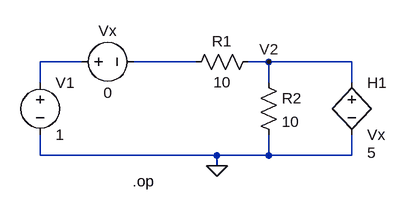
[diagram p0: schematic nodal10.asc]
nodal10.asc, the LTspice schematic file:
Version 4
SHEET 1 880 680
WIRE -112 80 -176 80
WIRE 64 80 -32 80
WIRE 176 80 144 80
WIRE 304 80 176 80
WIRE -176 112 -176 80
WIRE 176 112 176 80
WIRE 304 112 304 80
WIRE -176 224 -176 192
WIRE 96 224 -176 224
WIRE 176 224 176 192
WIRE 176 224 96 224
WIRE 304 224 304 192
WIRE 304 224 176 224
WIRE 96 240 96 224
FLAG 96 240 0
FLAG 176 80 V2
SYMBOL voltage -176 96 R0
WINDOW 123 0 0 Left 0
WINDOW 39 0 0 Left 0
SYMATTR InstName V1
SYMATTR Value 1
SYMBOL res 160 64 R90
WINDOW 0 0 56 VBottom 2
WINDOW 3 32 56 VTop 2
SYMATTR InstName R1
SYMATTR Value 10
SYMBOL res 160 96 R0
SYMATTR InstName R2
SYMATTR Value 10
SYMBOL h 304 96 R0
WINDOW 123 24 124 Left 2
SYMATTR InstName H1
SYMATTR Value Vx
SYMATTR Value2 5
SYMBOL voltage -128 80 R270
WINDOW 0 32 56 VTop 2
WINDOW 3 -32 56 VBottom 2
WINDOW 123 0 0 Left 0
WINDOW 39 0 0 Left 0
SYMATTR InstName Vx
SYMATTR Value 0
TEXT -34 264 Left 2 !.op

The netlist it stands for:
* nodal10.asc
V1 N001 0 1
R1 V2 N002 10
R2 V2 0 10
H1 V2 0 Vx 5
Vx N001 N002 0
.op
.backanno
.end